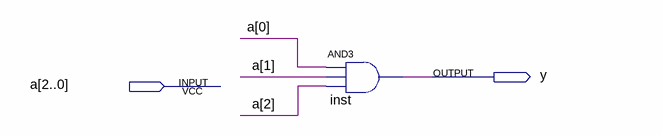
[diagram p0: schematic sheet]
// Quartus schematic and_3.bdf as structural Verilog: 1 symbols, 2 pins
module and_3 (
  input  [2:0] a,
  output y
);

  and inst (y, a[0], a[1], a[2]);
endmodule
